# Altium schematic sheet LED Chaser.SchDoc: LED CHASER
size A4; Date: 23/09/22; Author: Oreoluwa Oluwafemi; Engineer: Oreoluwa Oluwafemi; SheetNumber: 1; SheetTotal: 1; Time: 22:56
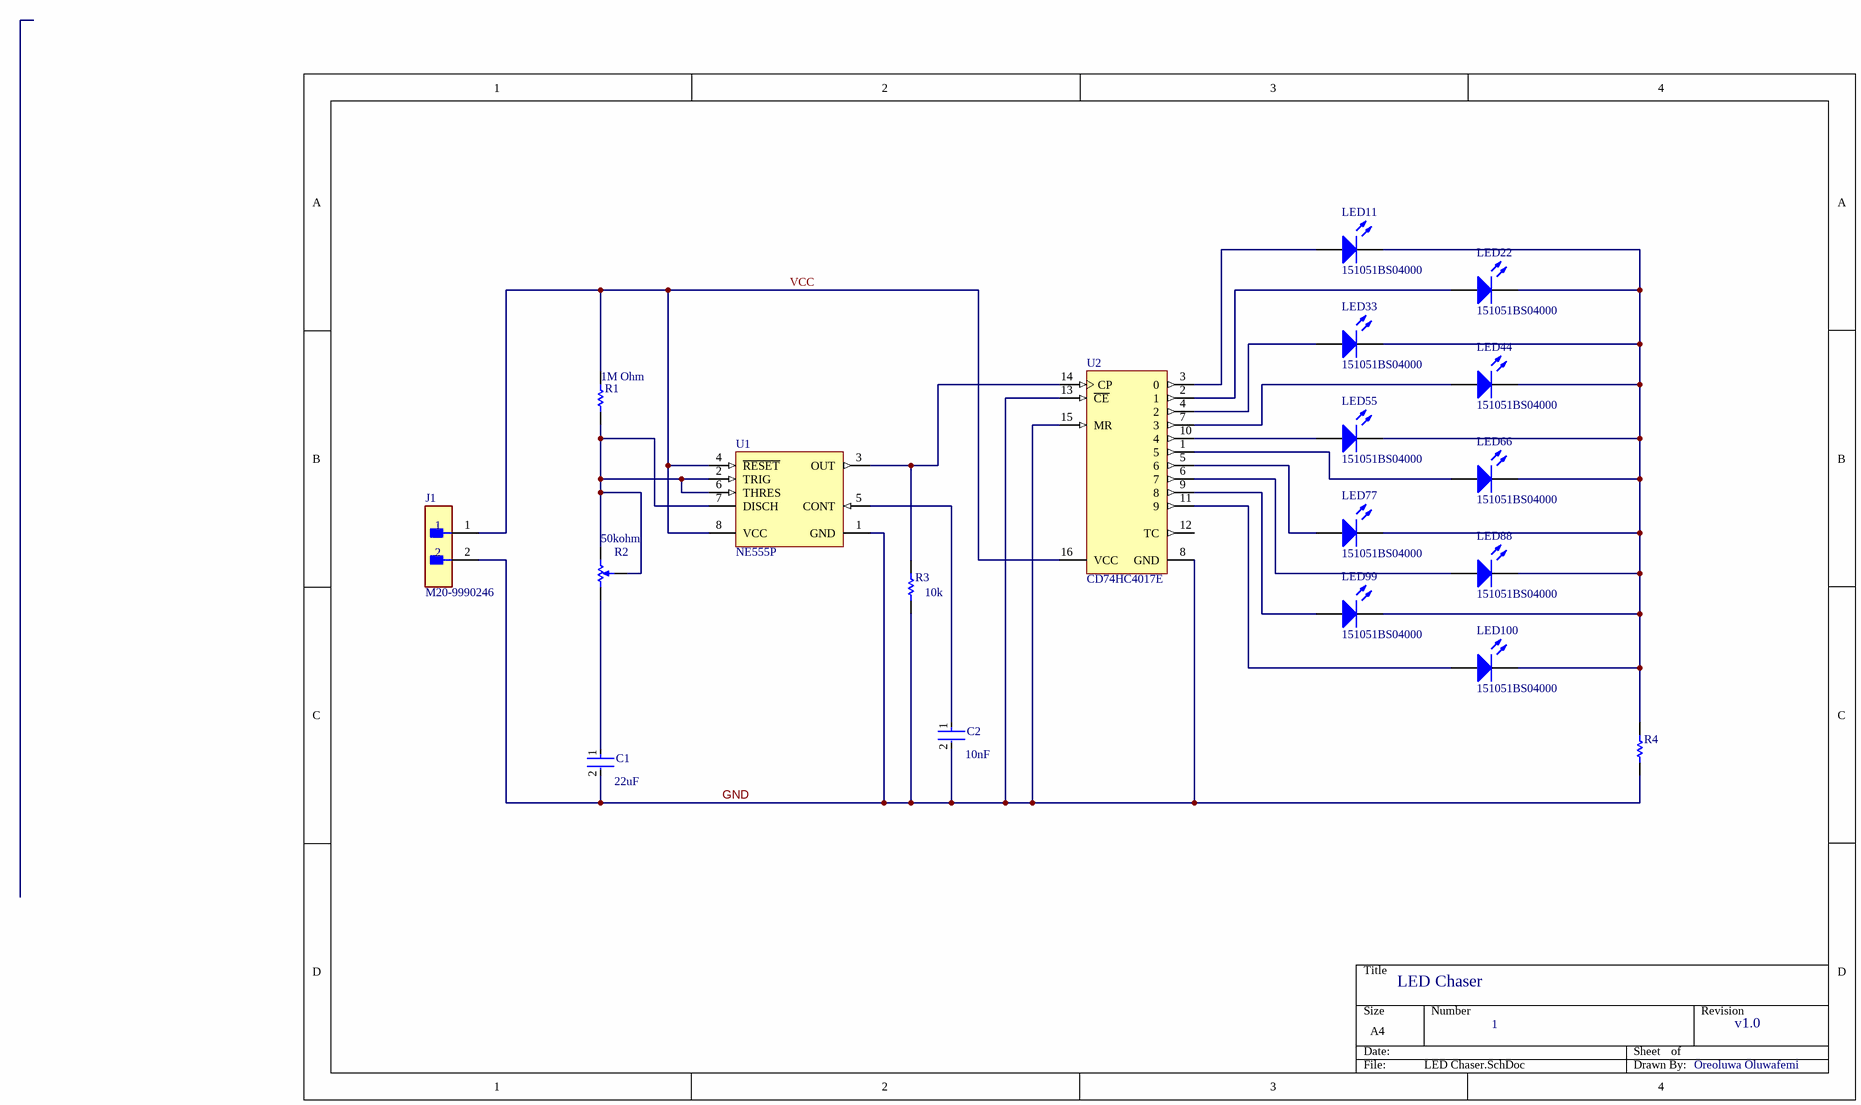
[diagram p0: LED Chaser.SchDoc]

## Parts
C1  Capacitance: 22uF  [FP-RCEWM1-MFG]  (hidden comment: RCER71E226MWM1H03A)
C2  Capacitance: 10nF  [FP-RCEWM1-MFG]  (hidden comment: RCER71E226MWM1H03A)
J1  M20-9990246  [FP-M20-9990246-MFG]
LED11  151051BS04000  [Type 5mm]
LED22  151051BS04000  [Type 5mm]
LED33  151051BS04000  [Type 5mm]
LED44  151051BS04000  [Type 5mm]
LED55  151051BS04000  [Type 5mm]
LED66  151051BS04000  [Type 5mm]
LED77  151051BS04000  [Type 5mm]
LED88  151051BS04000  [Type 5mm]
LED99  151051BS04000  [Type 5mm]
LED100  151051BS04000  [Type 5mm]
R1  Resistance: 1M Ohm  [RESA60-630X240]  (hidden comment: MFR-25FBF52-100K)
R2  Track Resistance: 50kohm  [BOUR-3313J-1_V]  (hidden comment: 3313J-1-503E)
R3  Resistance (Ohms): 10k  [OMTE-RES7X2.5-2]  (hidden comment: OD103JE)
R4  OD103JE  [OMTE-RES7X2.5-2]  (value not drawn)
U1  NE555P  [P0008A]
U2  CD74HC4017E  [N0016A]

## Nets
GND: C1.2 C2.2 J1.2 R3.1 R4.1 U1.1(GND) U2.8(GND) U2.13(~{CE}) U2.15(MR)
VCC: J1.1 R1.2 U1.4(~{RESET}) U1.8(VCC) U2.16(VCC)
NetC1_1: C1.1 R2.1
NetC2_1: C2.1 U1.5(CONT)
NetLED11_1: LED11.1(K) LED22.1(K) LED33.1(K) LED44.1(K) LED55.1(K) LED66.1(K) LED77.1(K) LED88.1(K) LED99.1(K) LED100.1(K) R4.2
NetLED11_2: LED11.2(A) U2.3(0)
NetLED22_2: LED22.2(A) U2.2(1)
NetLED33_2: LED33.2(A) U2.4(2)
NetLED44_2: LED44.2(A) U2.7(3)
NetLED55_2: LED55.2(A) U2.10(4)
NetLED66_2: LED66.2(A) U2.1(5)
NetLED77_2: LED77.2(A) U2.5(6)
NetLED88_2: LED88.2(A) U2.6(7)
NetLED99_2: LED99.2(A) U2.9(8)
NetLED100_2: LED100.2(A) U2.11(9)
NetR1_1: R1.1 R2.2 R2.3 U1.2(TRIG) U1.6(THRES) U1.7(DISCH)
NetR3_2: R3.2 U1.3(OUT) U2.14(CP)

Not connected (* = marked no-connect by the designer): U2 12(TC)

## Notes on the sheet
- LED Chaser
- 1
- v1.0
- Oreoluwa Oluwafemi

## Library data of the parts
C1 C2 = CMP-06035-003622-1: CAP CER 22UF 25V X7R RADIAL; Tolerance: 20%; Lead Diameter: 0.5mm; Lead/Base Style: Formed Leads; Height - Seated (Max): 0.295inch; Height: 7.5mm; Max Operating Temperature: 125°C; Package Quantity: 1500; Case/Package: Radial; Length: 0.217inch; Lead Pitch: 0.197inch; Voltage Rating (DC): 25V; Ratings: AEC-Q200; Mount: Through Hole; Packaging: Tape and Reel; Voltage Rating: 25V; Min Operating Temperature: -55°C; Width: 0.157inch; Resistor Type: Ceramic; Termination: Radial; Dielectric: X7R
J1 = CMP-15831-000009-1: CONN HEADER VERT 2POS 2.54MM; Manufacturer: Harwin; Conn Gender: Male; Conn Orientation: Vertical; Number Of Contacts: 2; Current Rating: 3A; ComponentLink2URL: https://cdn.harwin.com/pdfs/M20-999.pdf; ComponentLink2Description: Datasheet; Package: M20-9990246; Temperature: -40°C to +105°C; Octopart: https://octopart.com/m20-9990246-harwin-2590635; Mouser Description: 2.54mm (0.1") Pitch SIL Vertical PC Tail Pin Header, 6.1mm mating pin height, tin, 2 contacts; Temperature Range High: +105°C; Device Class L1: Connectors; RoHS: TRUE; Automotive: No; Height: 8.99mm; Number Of Rows: 1; Contact Material: Tin,Nickel; Category: Conn; Pitch: 2.54mm; Lead Free: Yes; Digikey Description: CONN HEADER VERT 2POS 2.54MM; Manufacturer Part Number: M20-9990246; Temperature Range Low: -40°C; Device Class L3: unset; Device Class L2: Headers and Wire Housings
LED11 LED22 LED33 LED44 LED55 LED66 LED77 LED88 LED99 LED100 = CMP-1488-00009-1: THT LED round mono-color color lens, WL-TMRW, Blue; Manufacturer: Wuerth Elektronik; PackageReference: Type 5mm; ComponentLink2Description: Datasheet; ComponentLink1Description: Manufacturer URL; Emitting color: Blue; ComponentLink1URL: http://www.we-online.com; PartNumber: 151051BS04000; ComponentLink2URL: http://katalog.we-online.de/pbs/datasheet/7448042001.pdfhttp://katalog.we-online.de/pbs/datasheet/7448042001.pdfhttp://katalog.we-online.de/pbs/datasheet/7448042001.pdfhttp://katalog.we-online.de/pbs/datasheet/151051BS04000.pdf
R1 = CMP-1659-00073-1: Axial Resistor, 100 KOhm, +/- 1%, 0.25 W, -55 to 155 degC, 2-Pin THD, RoHS, Bulk; Voltage Rating: 250 V; Power Rating: 250 mW; PackageDescription: 2-Pin Axial Lead, Dia 2.4 mm, Body Length 6.3 mm; PackageReference: MFR-25; Length: 0.248 inch; ComponentLink2Description: Datasheet; Packaging: Bulk; DatasheetVersion: Apr-13; Package Quantity: 200; Min Operating Temperature: -55 degC; ComponentLink2URL: http://www.yageo.com/documents/recent/Yageo%20LR_MFR_2013.pdf; RoHSCompliant: true; ComponentLink1URL: http://www.yageo.com/; Tolerance: 1%; Case\Package: Axial; Mount: Through Hole; ComponentLink1Description: Manufacturer URL; Max Operating Temperature: 155 degC
R2 = CMP-2000-05588-1: 3 mm Trimpot(R) Trimming Potentiometer, 50 KOhm, +/- 20%, 0.125 W, -55 to 125 degC, 3-Pin SMD, RoHS, Tape and Reel; Manufacturer: Bourns; SVHC: NoSVHC(19-Dec-2012); Temperature Coefficient: ±150ppm/°C; No. of Turns: 1; Power Rating: 125mW; Manufacturer URL: http://www.bourns.com/; Potentiometer Mounting: SMD; Package Description: 3-Pin Surface Mount Device, Body 3.5 x 3.2 mm, Pitch 1.15 mm; Package Reference: 3313J-1; Mounting Technology: SurfaceMount; Resistance Tolerance: ±20%; Datasheet Version: 05/2016; Datasheet URL: http://www.bourns.com/docs/Product-Datasheets/3313.pdf
R3 = CMP-2000-06865-1: Little Demon(R) Carbon Composition Molded OD Series, 250 V, 10 KOhm, +/-5%, -70 to 130 degC, 2-Pin THD, RoHS, Bulk; Manufacturer: Ohmite; Power Rating: 0.25W; Power (Watts): 0.25W,1/4W; Tolerance: ±5%; Online Catalog: OD,OF,OASeries,LittleDemon®; Catalog Drawings: OD,OF,OASeries; EDA / CAD Models: DownloadfromAcceleratedDesigns; Mounting Technology: ThroughHole; Datasheet Version: 06/2016; RoHS Information: LittleDemon"E"SeriesMaterialDeclaration; Number of Terminations: 2; Temperature Coefficient: -; Height: -; Composition: CarbonComposition; Package Description: 2-Pin THD Resistor, Body 7 x 2.5 mm, Lead Dia. 0.6 mm; Size / Dimension: 0.098"Diax0.276"L(2.50mmx7.00mm); Category: Resistors; Manufacturer URL: http://www.ohmite.com/; Features: PulseWithstanding; Family: ThroughHoleResistors; PartNumber: OD103JE; Supplier Device Package: Axial; Package / Case: Axial; Standard Package: 100; Package Reference: RES7X2.5; Operating Temperature: -; Series: LittleDemon®OD; Datasheet URL: http://www.ohmite.com/cat/res_od_of_oa.pdf; Packaging: Bulk
R4 = CMP-2000-06865-1: Little Demon(R) Carbon Composition Molded OD Series, 250 V, 10 KOhm, +/-5%, -70 to 130 degC, 2-Pin THD, RoHS, Bulk; Manufacturer: Ohmite; Resistance (Ohms): 10k; Power Rating: 0.25W; Power (Watts): 0.25W,1/4W; Tolerance: ±5%; Online Catalog: OD,OF,OASeries,LittleDemon®; Catalog Drawings: OD,OF,OASeries; EDA / CAD Models: DownloadfromAcceleratedDesigns; Mounting Technology: ThroughHole; Datasheet Version: 06/2016; RoHS Information: LittleDemon"E"SeriesMaterialDeclaration; Number of Terminations: 2; Temperature Coefficient: -; Height: -; Composition: CarbonComposition; Package Description: 2-Pin THD Resistor, Body 7 x 2.5 mm, Lead Dia. 0.6 mm; Size / Dimension: 0.098"Diax0.276"L(2.50mmx7.00mm); Category: Resistors; Manufacturer URL: http://www.ohmite.com/; Features: PulseWithstanding; Family: ThroughHoleResistors; PartNumber: OD103JE; Supplier Device Package: Axial; Package / Case: Axial; Standard Package: 100; Package Reference: RES7X2.5; Operating Temperature: -; Series: LittleDemon®OD; Datasheet URL: http://www.ohmite.com/cat/res_od_of_oa.pdf; Packaging: Bulk
U1 = CMP-2000-04954-1: Precision Timer, 4.5 to 16 V, 0 to 70 degC, 8-Pin DIP, Pb-Free, Tube; Manufacturer: TexasInstruments; Maximum High Level Output Current: -200mA; Number of Internal Timers: 1; Operating Supply Voltage: 5; Maximum Low Level Output Current: 200mA; Rad Hard: No; Packaging: Rail/Tube; Manufacturer URL: http://www.ti.com/; Package Reference: P8; Package Description: 8-Pin Double In-line Package, Body 9.59 x 6.35 mm, Pitch 2.54 mm; Package URL: http://www.ti.com/lit/ml/mpdi001b/mpdi001b.pdf; Type: Standard; Datasheet URL: http://www.ti.com/general/docs/lit/getliterature.tsp?genericPartNumber=NE555&fileType=pdf; Category: Timer; Package: 8PDIP; Datasheet Version: Rev. I, 09/2014
U2 = CMP-1623-00548-2: High Speed CMOS Logic Decade Counter/Divider with 10 Decoded Outputs, N0016A, TUBE; Manufacturer: Texas Instruments; tpd @ Nom Voltage(Max)(ns): 54; Inputs: 1; Input Type: LVTTL/CMOS; Voltage(Nom)(V): 3.3,5; Schmitt Trigger: No; Output Drive (IOL/IOH)(Max)(mA): 5.2/-5.2; Bits(#): 10; VCC(Max)(V): 6; Technology Family: HC; ICC @ Nom Voltage(Max)(mA): 0.08; Rating: Catalog; F @ Nom Voltage(Max)(Mhz): 28; VCC(Min)(V): 2; Generic Part Number: CD74HC4017; Code_JEDEC: MS-001; DatasheetVersion: SCHS200D; Output Type: CMOS; Type: Decade; Operating Temperature Range(C): -55 to 125; PackageReference: N0016A; Function: Counter